# EAGLE design reflow_oven_main (EAGLE 7.1.0)
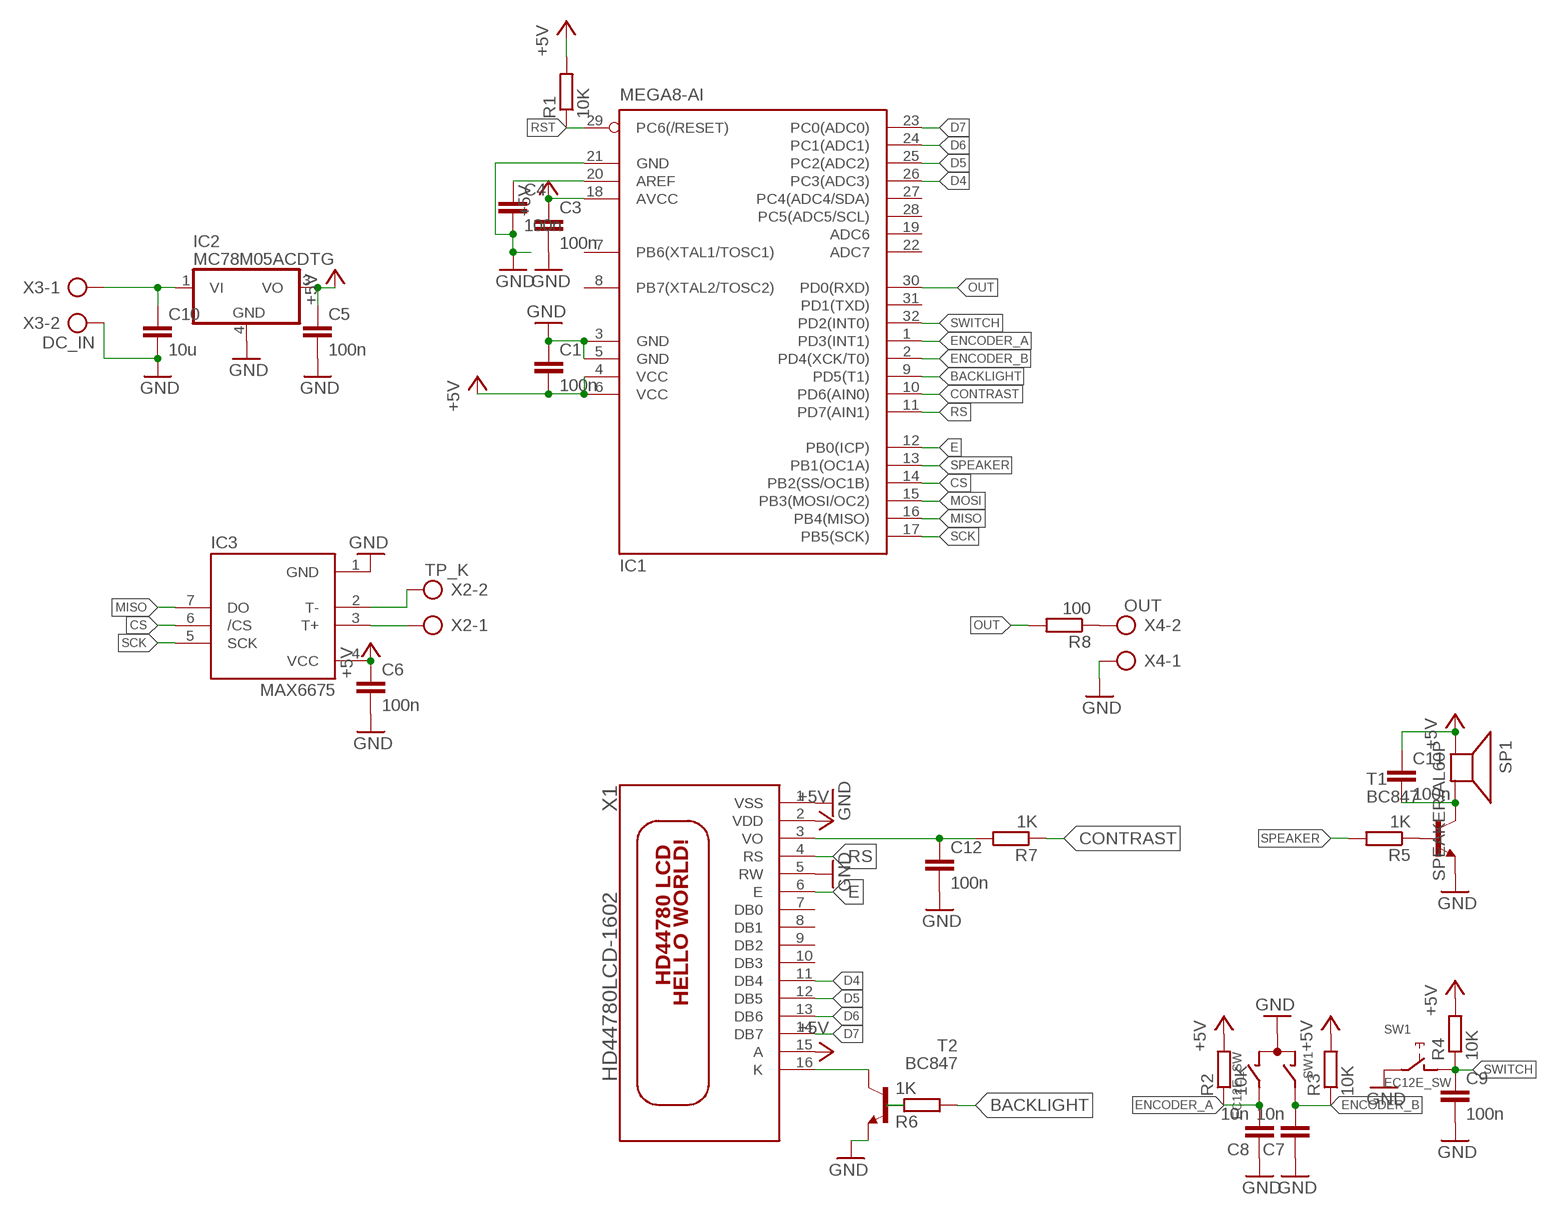
[diagram p0: schematic, sheet 1]

## Parts
C1  100n  C-EUC0603  [C0603]
C3  100n  C-EUC0603  [C0603]
C4  100n  C-EUC0603  [C0603]
C5  100n  C-EUC0603  [C0603]
C6  100n  C-EUC0603  [C0603]
C7  10n  C-EUC0603  [C0603]
C8  10n  C-EUC0603  [C0603]
C9  100n  C-EUC0603  [C0603]
C10  10u  C-EUC0805  [C0805]
C11  100n  C-EUC0603  [C0603]
C12  100n  C-EUC0603  [C0603]
IC1  MEGA8-AI  [TQFP32-08]
IC2  MC78M05ACDTG  [DPACK_3]
IC3  MAX6675  [SO08]
R1  10K  R-EU_R0603  [R0603]
R2  10K  R-EU_R0603  [R0603]
R3  10K  R-EU_R0603  [R0603]
R4  10K  R-EU_R0603  [R0603]
R5  1K  R-EU_R0603  [R0603]
R6  1K  R-EU_R0603  [R0603]
R7  1K  R-EU_R0603  [R0603]
R8  100  R-EU_R0603  [R0603]
SP1  SPEAKER/AL60P  [AL60P]
SW1  EC12E_SW  [ALPS_EC12E_SW]
T1  BC847  [SOT23]
T2  BC847  [SOT23]
X1  HD44780LCD-1602  [LCD1602]
X2  TP_K  AK500/2  [AK500/2]
X3  DC_IN  AK500/2  [AK500/2]
X4  OUT  AK500/2  [AK500/2]

## Nets
+5V: C1.2 C3.1 C5.1 C6.1 C11.1 IC1.4(VCC) IC1.6(VCC) IC1.18(AVCC) IC2.3(VO) IC3.4(VCC) R1.2 R2.2 R3.2 R4.2 SP1.1(+) X1.2(VDD) X1.15(A)
BACKLIGHT: IC1.9(PD5(T1)) R6.2
CONTRAST: IC1.10(PD6(AIN0)) R7.1
CS: IC1.14(PB2(SS/OC1B)) IC3.6(/CS)
D4: IC1.26(PC3(ADC3)) X1.11(DB4)
D5: IC1.25(PC2(ADC2)) X1.12(DB5)
D6: IC1.24(PC1(ADC1)) X1.13(DB6)
D7: IC1.23(PC0(ADC0)) X1.14(DB7)
E: IC1.12(PB0(ICP)) X1.6(E)
ENCODER_A: C8.2 IC1.1(PD3(INT1)) R2.1 SW1.B
ENCODER_B: C7.2 IC1.2(PD4(XCK/T0)) R3.1 SW1.A
GND: C1.1 C3.2 C4.2 C5.2 C6.2 C7.1 C8.1 C9.2 C10.2 C12.2 IC1.3(GND) IC1.5(GND) IC1.21(GND) IC2.4(GND) IC3.1(GND) SW1.C SW1.E T1.2(E) T2.2(E) X1.1(VSS) X1.5(RW) X3.2 X4.1
MISO: IC1.16(PB4(MISO)) IC3.7(DO)
MOSI: IC1.15(PB3(MOSI/OC2))
N$1: T2.3(C) X1.16(K)
N$4: R8.1 X4.2
N$5: C11.2 SP1.2(-) T1.3(C)
N$6: R5.1 T1.1(B)
N$12: R6.1 T2.1(B)
N$14: C4.1 IC1.20(AREF)
N$19: C12.1 R7.2 X1.3(VO)
N$25: C10.1 IC2.1(VI) X3.1
OUT: IC1.30(PD0(RXD)) R8.2
RS: IC1.11(PD7(AIN1)) X1.4(RS)
RST: IC1.29(PC6(/RESET)) R1.1
SCK: IC1.17(PB5(SCK)) IC3.5(SCK)
SPEAKER: IC1.13(PB1(OC1A)) R5.2
SWITCH: C9.1 IC1.32(PD2(INT0)) R4.1 SW1.D
T+: IC3.3(T+) X2.1
T-: IC3.2(T-) X2.2
Unconnected: IC1.7(PB6(XTAL1/TOSC1)) IC1.8(PB7(XTAL2/TOSC2)) IC1.19(ADC6) IC1.22(ADC7) IC1.27(PC4(ADC4/SDA)) IC1.28(PC5(ADC5/SCL)) IC1.31(PD1(TXD)) SW1.GND1(G) SW1.GND2(G) X1.7(DB0) X1.8(DB1) X1.9(DB2) X1.10(DB3)

## Library data of the parts
C1 C3-C12 = rcl:C-EU: CAPACITOR, European symbol
IC1 = atmega-atxmega:MEGA8: MICROCONTROLLER 8 Kbytes FLASH, 1 kbytes SRAM, 512 bytes EEPROM, USART, 6-channel 10 bit ADC, 2-channel 8 bit ADC Pin compatible with Atmega48, ATMega88, ATMega168 Source: avr.lbr; MPN: ATMEGA8-16AU; OC_FARNELL: 9171371; OC_NEWARK: 73M8863
IC2 = linear:MC78M: 500 mA Positive Voltage Regulators Source: Data sheet <http://www.onsemi.com/pub_link/Collateral/MC78M00-D.PDF>
IC3 = adafruit:MAX6675
R1-R8 = rcl:R-EU_: RESISTOR, European symbol
SP1 = adafruit:SPEAKER: SPEAKER Source: Buerklin Added PS12 (for part # PS1240 piezo) http://www.ladyada.net/library/pcb/eaglelibrary.html
SW1 = switch-alps:EC12E_SW: ALPS rotary Encoder EC12E series with switch; MPN: EC12E2424407; OC_FARNELL: 1520813; OC_NEWARK: 74M1068
T1 T2 = nxp_60:BC847: 45 V, 100 mA NPN general-purpose transistors NPN general-purpose transistor AAL Eindhoven MK
X1 = adafruit:HD44780LCD: HD44780 LCD Standard character type LCDs, available in sizes from 8x1 to 40x4!
X2-X4 = con-ptr500:AK500/2: CONNECTOR; OC_FARNELL: unknown; OC_NEWARK: unknown

## Board
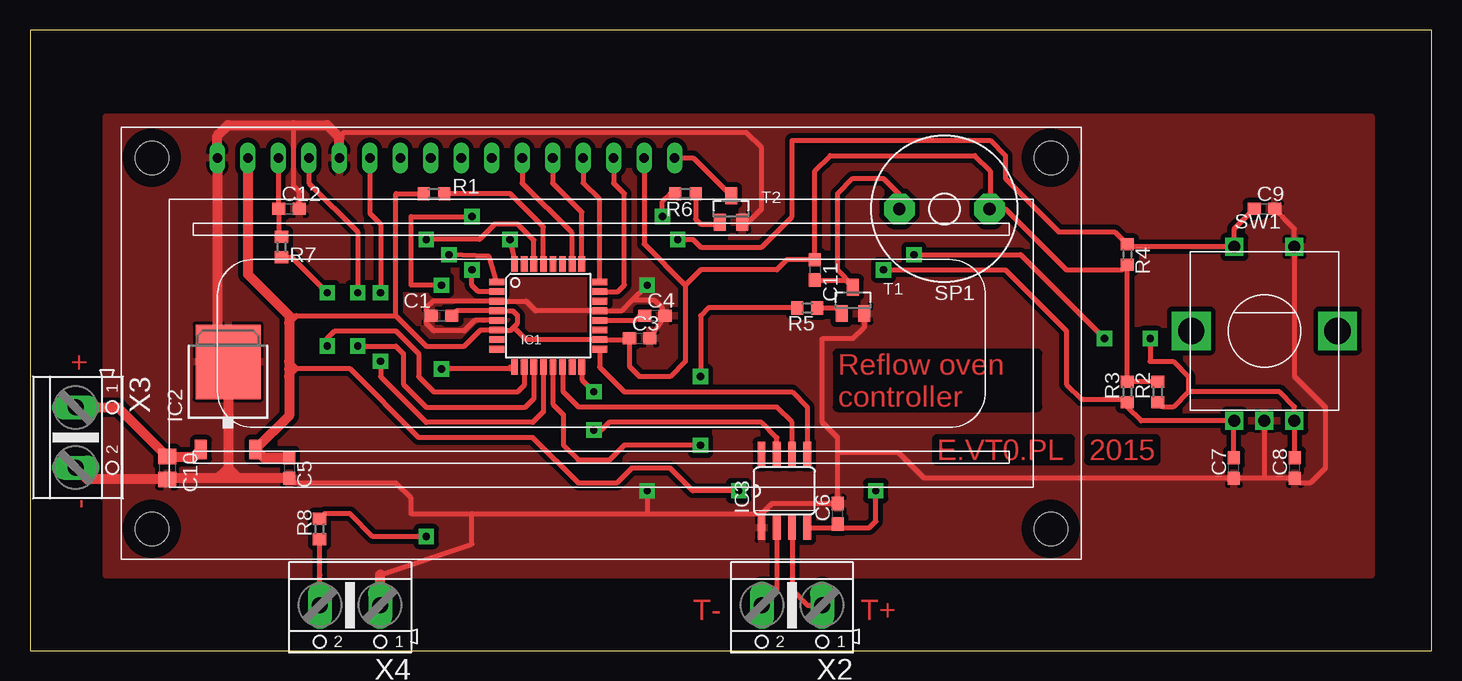
[diagram p1: board, top side]
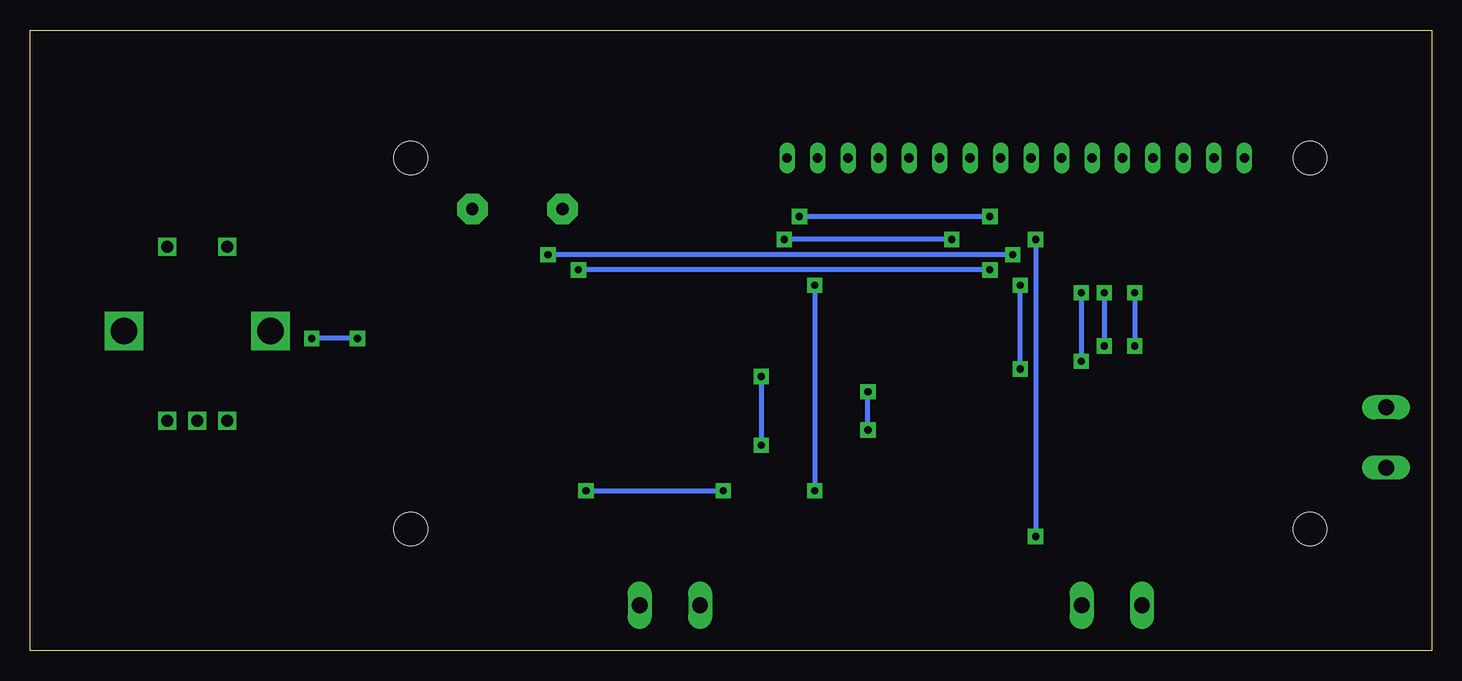
[diagram p2: board, bottom side, seen from below]

Size 116.82 x 51.74 mm. Coordinates in mm from the lower left corner, seen from the top.
Outline: 0,0 116.82,0 116.82,51.74 0,51.74 0,0
Copper layers (1*16): Top 0.035mm / dielectric 1.5mm / Bottom 0.035mm
Design rules "default": minimum track width 10mil, minimum drill 24mil, track to track 8mil, track to pad 8mil, pad to pad 8mil, via to via 8mil, smd to smd 8mil, copper to edge 40mil, drill to drill 8mil, minimum pad ring 10mil, minimum via ring 8mil, stop-mask expansion 4mil, vias tented up to drill 0mil, thermal gap 10mil

### Footprints (pad centres in the part's own frame; a part is rotated, then mirrored left to right if it is on the bottom)
C0603 = smd 1.1 x 1: 1 -0.85,0; 2 0.85,0
C0805 = smd 1.3 x 1.5: 1 -0.95,0; 2 0.95,0
TQFP32-08 = smd 1.27 x 0.559: 1 -4.293,2.8; 2 -4.293,2; 3 -4.293,1.2; 4 -4.293,0.4; 5 -4.293,-0.4; 6 -4.293,-1.2; 7 -4.293,-2; 8 -4.293,-2.8; 17 4.293,-2.8; 18 4.293,-2; 19 4.293,-1.2; 20 4.293,-0.4; 21 4.293,0.4; 22 4.293,1.2; 23 4.293,2; 24 4.293,2.8 | smd 0.559 x 1.27: 9 -2.8,-4.293; 10 -2,-4.293; 11 -1.2,-4.293; 12 -0.4,-4.293; 13 0.4,-4.293; 14 1.2,-4.293; 15 2,-4.293; 16 2.8,-4.293; 25 2.8,4.293; 26 2,4.293; 27 1.2,4.293; 28 0.4,4.293; 29 -0.4,4.293; 30 -1.2,4.293; 31 -2,4.293; 32 -2.8,4.293
DPACK_3 = smd 1 x 1.6: 1 -2.28,-4.8; 3 2.28,-4.8 | smd 5.4 x 6.2: 4 0,2.5
SO08 = smd 0.66 x 2.032: 1 -1.905,-3.073; 2 -0.635,-3.073; 3 0.635,-3.073; 4 1.905,-3.073; 5 1.905,3.073; 6 0.635,3.073; 7 -0.635,3.073; 8 -1.905,3.073
R0603 = smd 1 x 1.1: 1 -0.85,0; 2 0.85,0
AL60P = drill 1.016 pad 2.54 octagon: 1 -3.759,0; 2 3.759,0
ALPS_EC12E_SW = drill 1 square: A -2.5,-7.5; B 2.5,-7.5; C 0,-7.5; D -2.5,7; E 2.5,7 | drill 2.2 square: GND1 -6.1,0; GND2 6.1,0
SOT23 = smd 1 x 1.4: 1 -0.95,-1.1; 2 0.95,-1.1; 3 0,1.1
LCD1602 = drill 0.8 long: 1 8,33.46; 2 10.54,33.46; 3 13.08,33.46; 4 15.62,33.46; 5 18.16,33.46; 6 20.7,33.46; 7 23.24,33.46; 8 25.78,33.46; 9 28.32,33.46; 10 30.86,33.46; 11 33.4,33.46; 12 35.94,33.46; 13 38.48,33.46; 14 41.02,33.46; 15 43.56,33.46; 16 46.1,33.46 | hole 2.8: 2.54,2.54; 2.54,33.46; 77.46,33.46; 77.46,2.54
AK500/2 = drill 1.321 long: 1 -2.515,0; 2 2.515,0

### Placement (x,y rotation side)
C1  34.29,27.94 0 top
C3  50.8,26.04 0 top
C4  52.07,27.94 0 top
C5  21.59,15.24 270 top
C6  67.31,11.43 90 top
C7  100.33,15.24 90 top
C8  105.41,15.24 90 top
C9  102.87,36.83 0 top
C10  11.43,15.24 270 top
C11  65.41,31.75 270 top
C12  21.59,36.83 0 top
IC1  43.18,27.94 0 top
IC2  16.51,21.59 0 top
IC3  62.87,13.34 0 top
R1  33.66,38.1 180 top
R2  93.98,21.59 90 top
R3  91.44,21.59 90 top
R4  91.44,33.02 270 top
R5  64.77,28.57 180 top
R6  54.61,38.1 180 top
R7  20.95,33.66 90 top
R8  24.13,10.16 90 top
SP1  76.2,36.83 180 top
SW1  102.87,26.67 0 top
T1  68.58,29.21 0 top
T2  58.42,36.83 0 top
X1  7.62,7.62 0 top
X2  63.5,3.81 180 top
X3  3.81,17.78 270 top
X4  26.67,3.81 180 top

### Tracks (layer width: path | path; a pad name or v marks a point on that pad's centre or on a via)
+5V  (via drill 0.6 pad 1.27)
  Top 0.406: C6.1 66.99,10.26 IC3.4 69.95,10.26 70.48,10.79 v70.48,13.34 | R2.2 R3.2 R4.2 91.02,31.75 86.36,31.75 81.28,36.83 SP1.1 80.01,36.88 80.01,40.01 78.74,41.27 66.67,41.27 65.41,40.01 C11.1 63.08,32.6 62.23,31.75 55.88,31.75 54.61,30.48 | C1.2 35.54,28.34 IC1.4 40.24,28.34 40.64,27.94 40.64,27.3 40.32,26.99 | 40.32,26.99 40.08,26.74 IC1.6 37.53,26.74 36.2,25.4 33.02,25.4 30.48,27.94 | 40.32,26.99 41.37,25.94 IC1.18 49.85,25.94 C3.1 49.95,23.71 50.8,22.86 53.34,22.86 54.61,24.13 54.61,30.48 | X1.15 51.18,33.91 54.61,30.48 | 21.59,27.94 22.23,27.94 | 22.23,27.94 30.48,27.94 | 30.48,27.94 30.48,38.1 R1.2 | v59.05,13.34 55.24,13.34 53.34,15.24 50.16,15.24 48.9,13.97 45.72,13.97 41.91,17.78 32.38,17.78 26.67,23.5 22.23,23.5 | 21.8,15.88 C5.1 | 22.23,23.5 21.59,23.5 | 21.59,22.86 22.23,23.5 | 22.23,23.5 21.59,24.13 | 21.59,27.3 22.23,27.94
  Top 0.813: C5.1 19.49,16.09 IC2.3 21.59,19.59 21.59,22.86 21.59,23.5 21.59,24.13 21.59,27.3 21.59,27.94 18.16,31.37 X1.2
  Bottom 0.406: v70.48,13.34 v59.05,13.34
BACKLIGHT  (via drill 0.6 pad 1.27)
  Top 0.406: IC1.9 40.01,23.65 40.01,23.5 v34.29,23.5 | v34.29,30.48 31.75,30.48 31.75,36.2 v36.83,36.2 | v52.7,36.2 52.7,37.47 53.34,38.1 R6.2
  Bottom 0.406: v34.29,23.5 v34.29,30.48 | v36.83,36.2 v52.7,36.2
CONTRAST  (via drill 0.6 pad 1.27)
  Top 0.406: R7.1 21.8,32.8 v24.77,29.84 | v24.77,25.4 24.77,26.04 25.4,26.67 30.48,26.67 32.38,24.77 32.38,22.86 33.66,21.59 40.64,21.59 41.18,22.13 IC1.10
  Bottom 0.406: v24.77,29.84 v24.77,25.4
CS
  Top 0.406: IC3.6 63.5,19.05 62.23,20.32 45.72,20.32 44.45,21.59 44.45,23.58 IC1.14
D4
  Top 0.406: IC1.26 45.18,34.83 41.02,38.99 X1.11
D5
  Top 0.406: IC1.25 45.98,36.57 43.56,38.99 X1.12
D6
  Top 0.406: IC1.24 47.47,37.62 46.1,38.99 X1.13
D7
  Top 0.406: IC1.23 48.99,29.94 49.53,30.48 49.53,38.1 48.64,38.99 X1.14
E  (via drill 0.6 pad 1.27)
  Top 0.406: X1.6 28.32,36.45 29.21,35.56 v29.21,29.84 | v29.21,24.13 29.21,22.86 33.02,19.05 41.91,19.05 42.78,19.92 IC1.12
  Bottom 0.406: v29.21,29.84 v29.21,24.13
ENCODER_A  (via drill 0.6 pad 1.27)
  Top 0.406: C8.2 105.41,19.13 SW1.B 105.37,20.36 104.14,21.59 96.52,21.59 | 96.52,21.59 95.25,20.32 94.4,20.32 R2.1 | IC1.1 38.25,32.87 v34.92,33.02 | v73.66,33.02 82.55,33.02 v89.53,26.04 | v93.34,26.04 93.34,24.13 95.25,24.13 96.52,22.86 96.52,21.59
  Bottom 0.406: v34.92,33.02 v73.66,33.02 | v89.53,26.04 v93.34,26.04
ENCODER_B  (via drill 0.6 pad 1.27)
  Top 0.406: C7.2 100.33,19.13 SW1.A 92.59,19.17 91.44,20.32 R3.1 91.22,20.95 87.63,20.95 86.36,22.23 86.36,26.67 81.28,31.75 v71.12,31.75 | IC1.2 37.37,29.94 36.83,30.48 v36.83,31.75
  Bottom 0.406: v36.83,31.75 v71.12,31.75
GND  (via drill 0.6 pad 1.27)
  Top 0.406: C12.2 22.44,38.27 21.97,38.73 21.97,43.81 | 102.87,14.39 C8.1 105.83,13.97 106.68,13.97 107.95,15.24 107.95,20.32 105.37,22.9 SW1.E 105.37,35.18 C9.2 | 102.87,14.39 C7.1 74.51,14.39 72.39,16.51 67.31,16.51 | SW1.C 102.87,14.39 | T2.2 59.86,35.73 60.96,36.83 60.96,41.91 59.69,43.18 26.16,43.18 25.78,42.8 | C3.2 C4.2 52.7,28.16 52.7,28.57 52.07,29.21 50.16,29.21 | IC1.5 37.06,27.54 36.2,26.67 33.66,26.67 33.02,27.3 33.02,27.52 C1.1 33.02,28.36 33.02,28.57 33.59,29.14 IC1.3 41.34,29.14 42.15,28.34 IC1.21 49.3,28.34 50.16,29.21 | C5.2 22.01,13.97 30.48,13.97 31.75,12.7 31.75,11.43 36.83,11.43 | 36.83,11.43 51.44,11.43 | 51.44,11.43 60.86,11.43 IC3.1 60.96,11.43 61.81,12.28 C6.2 67.31,16.51 | 50.16,29.21 v51.44,30.48 | v51.44,13.34 51.44,11.43 | 67.31,16.51 67.31,17.78 66.04,19.05 66.04,26.04 68.58,26.04 69.53,26.98 T1.2 | 29.21,6.35 36.83,8.89 36.83,11.43
  Top 0.813: C5.2 16.51,14.39 | 16.51,14.39 11.43,14.39 C10.2 4.79,14.29 X3.2 | 16.51,15.24 IC2.4 15.62,24.98 X1.1 15.62,42.92 16.51,43.81 21.97,43.81 24.77,43.81 25.78,42.8 X1.5 | 16.51,15.24 16.51,14.39 | 16.51,15.24 15.88,14.61 | 16.51,15.24 17.14,14.61 | X4.1 29.18,6.33 29.21,6.35
  Bottom 0.406: v51.44,30.48 v51.44,13.34
  pour Top (isolate 0.406): 7.62,44.45 111.76,44.45 111.76,6.35 6.35,6.35 6.35,44.45
MISO  (via drill 0.6 pad 1.27)
  Top 0.406: IC3.7 62.23,17.78 60.96,19.05 48.26,19.05 47.62,18.41 v46.99,18.41 | IC1.16 45.98,22.6 v46.99,21.59
  Bottom 0.406: v46.99,18.41 v46.99,21.59
N$1
  Top 0.406: X1.16 55.27,41.08 T2.3
N$4
  Top 0.406: X4.2 24.16,6.33 24.13,7.62 R8.1
N$5
  Top 0.406: C11.2 67.99,30.9 T1.3 68.58,30.48 67.31,31.75 67.31,38.1 68.58,39.37 71.12,39.37 72.39,38.1 72.39,36.88 SP1.2
N$6
  Top 0.406: R5.1 67.17,28.57 T1.1
N$12
  Top 0.406: R6.1 55.46,35.98 55.88,35.56 57.3,35.56 T2.1
N$14
  Top 0.406: IC1.20 50.4,27.54 50.8,27.94 C4.1
N$19
  Top 0.406: X1.3 20.7,36.87 C12.1 20.74,34.72 R7.2
N$25
  Top 0.813: X3.1 7.33,20.3 C10.1 13.63,16.19 IC2.1
OUT  (via drill 0.6 pad 1.27)
  Top 0.406: IC1.30 41.98,34.22 40.64,35.56 38.73,35.56 37.47,34.29 v33.02,34.29 | v33.02,9.53 28.57,9.53 26.67,11.43 24.55,11.43 R8.2
  Bottom 0.406: v33.02,34.29 v33.02,9.53
RS  (via drill 0.6 pad 1.27)
  Top 0.406: X1.4 23.24,38.99 27.3,34.92 v27.3,29.84 | v27.3,25.4 30.48,25.4 31.11,24.77 31.11,22.23 33.02,20.32 41.27,20.32 41.98,21.02 IC1.11
  Bottom 0.406: v27.3,29.84 v27.3,25.4
RST
  Top 0.406: IC1.29 42.78,35.33 40.01,38.1 R1.1
SCK
  Top 0.406: IC1.17 47.47,23.65 49.53,21.59 63.5,21.59 64.77,20.32 IC3.5
SPEAKER  (via drill 0.6 pad 1.27)
  Top 0.406: R5.2 56.52,28.57 55.88,27.94 v55.88,22.86 | v55.88,17.14 49.53,17.14 48.26,15.88 45.72,15.88 44.45,17.14 44.45,19.68 43.58,20.55 IC1.13
  Bottom 0.406: v55.88,22.86 v55.88,17.14
SWITCH  (via drill 0.6 pad 1.27)
  Top 0.406: C9.1 100.37,35.18 SW1.D 91.64,33.67 R4.1 90.39,34.92 85.72,34.92 81.28,39.37 81.28,41.27 80.01,42.55 63.5,42.55 63.5,36.2 60.96,33.66 55.88,33.66 55.24,34.29 v53.98,34.29 | IC1.32 40.38,32.65 v40.01,34.29
  Bottom 0.406: v40.01,34.29 v53.98,34.29
T+
  Top 0.406: IC3.3 63.5,5.08 64.77,3.81 X2.1
T-
  Top 0.406: IC3.2 62.23,5.05 X2.2

### Text on the board
Top: + | Reflow oven / controller | E.VT0.PL | 2015 | - | T- | T+